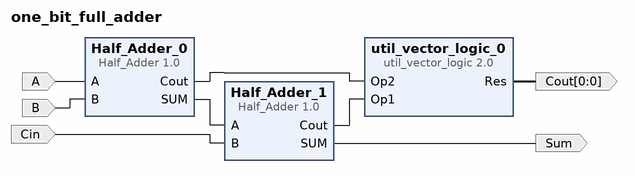
[diagram p0: block diagram of the top level]
# Vivado block design one_bit_full_adder, xc7vx485tffg1157-1, Vivado 2025.1
create_bd_design one_bit_full_adder

create_bd_port -dir I A
create_bd_port -dir I B
create_bd_port -dir I Cin
create_bd_port -dir O Sum
create_bd_port -dir O -from 0 -to 0 Cout

create_bd_cell -type ip -vlnv xilinx.com:user:Half_Adder:1.0 Half_Adder_0
create_bd_cell -type ip -vlnv xilinx.com:user:Half_Adder:1.0 Half_Adder_1
create_bd_cell -type ip -vlnv xilinx.com:ip:util_vector_logic:2.0 util_vector_logic_0
set_property -dict {CONFIG.C_OPERATION or CONFIG.C_SIZE 1} [get_bd_cells util_vector_logic_0]

# ---- connections ----

connect_bd_net [get_bd_ports A] [get_bd_pins Half_Adder_0/A]
connect_bd_net [get_bd_ports B] [get_bd_pins Half_Adder_0/B]
connect_bd_net [get_bd_ports Cin] [get_bd_pins Half_Adder_1/B]
connect_bd_net [get_bd_pins Half_Adder_0/Cout] [get_bd_pins util_vector_logic_0/Op2]
connect_bd_net [get_bd_pins Half_Adder_0/SUM] [get_bd_pins Half_Adder_1/A]
connect_bd_net [get_bd_pins Half_Adder_1/Cout] [get_bd_pins util_vector_logic_0/Op1]
connect_bd_net [get_bd_pins Half_Adder_1/SUM] [get_bd_ports Sum]
connect_bd_net [get_bd_pins util_vector_logic_0/Res] [get_bd_ports Cout]

validate_bd_design
save_bd_design
